# Altium schematic sheet Schematic.SchDoc
size 420 x 297 mm; SheetNumber: 1; SheetTotal: 1
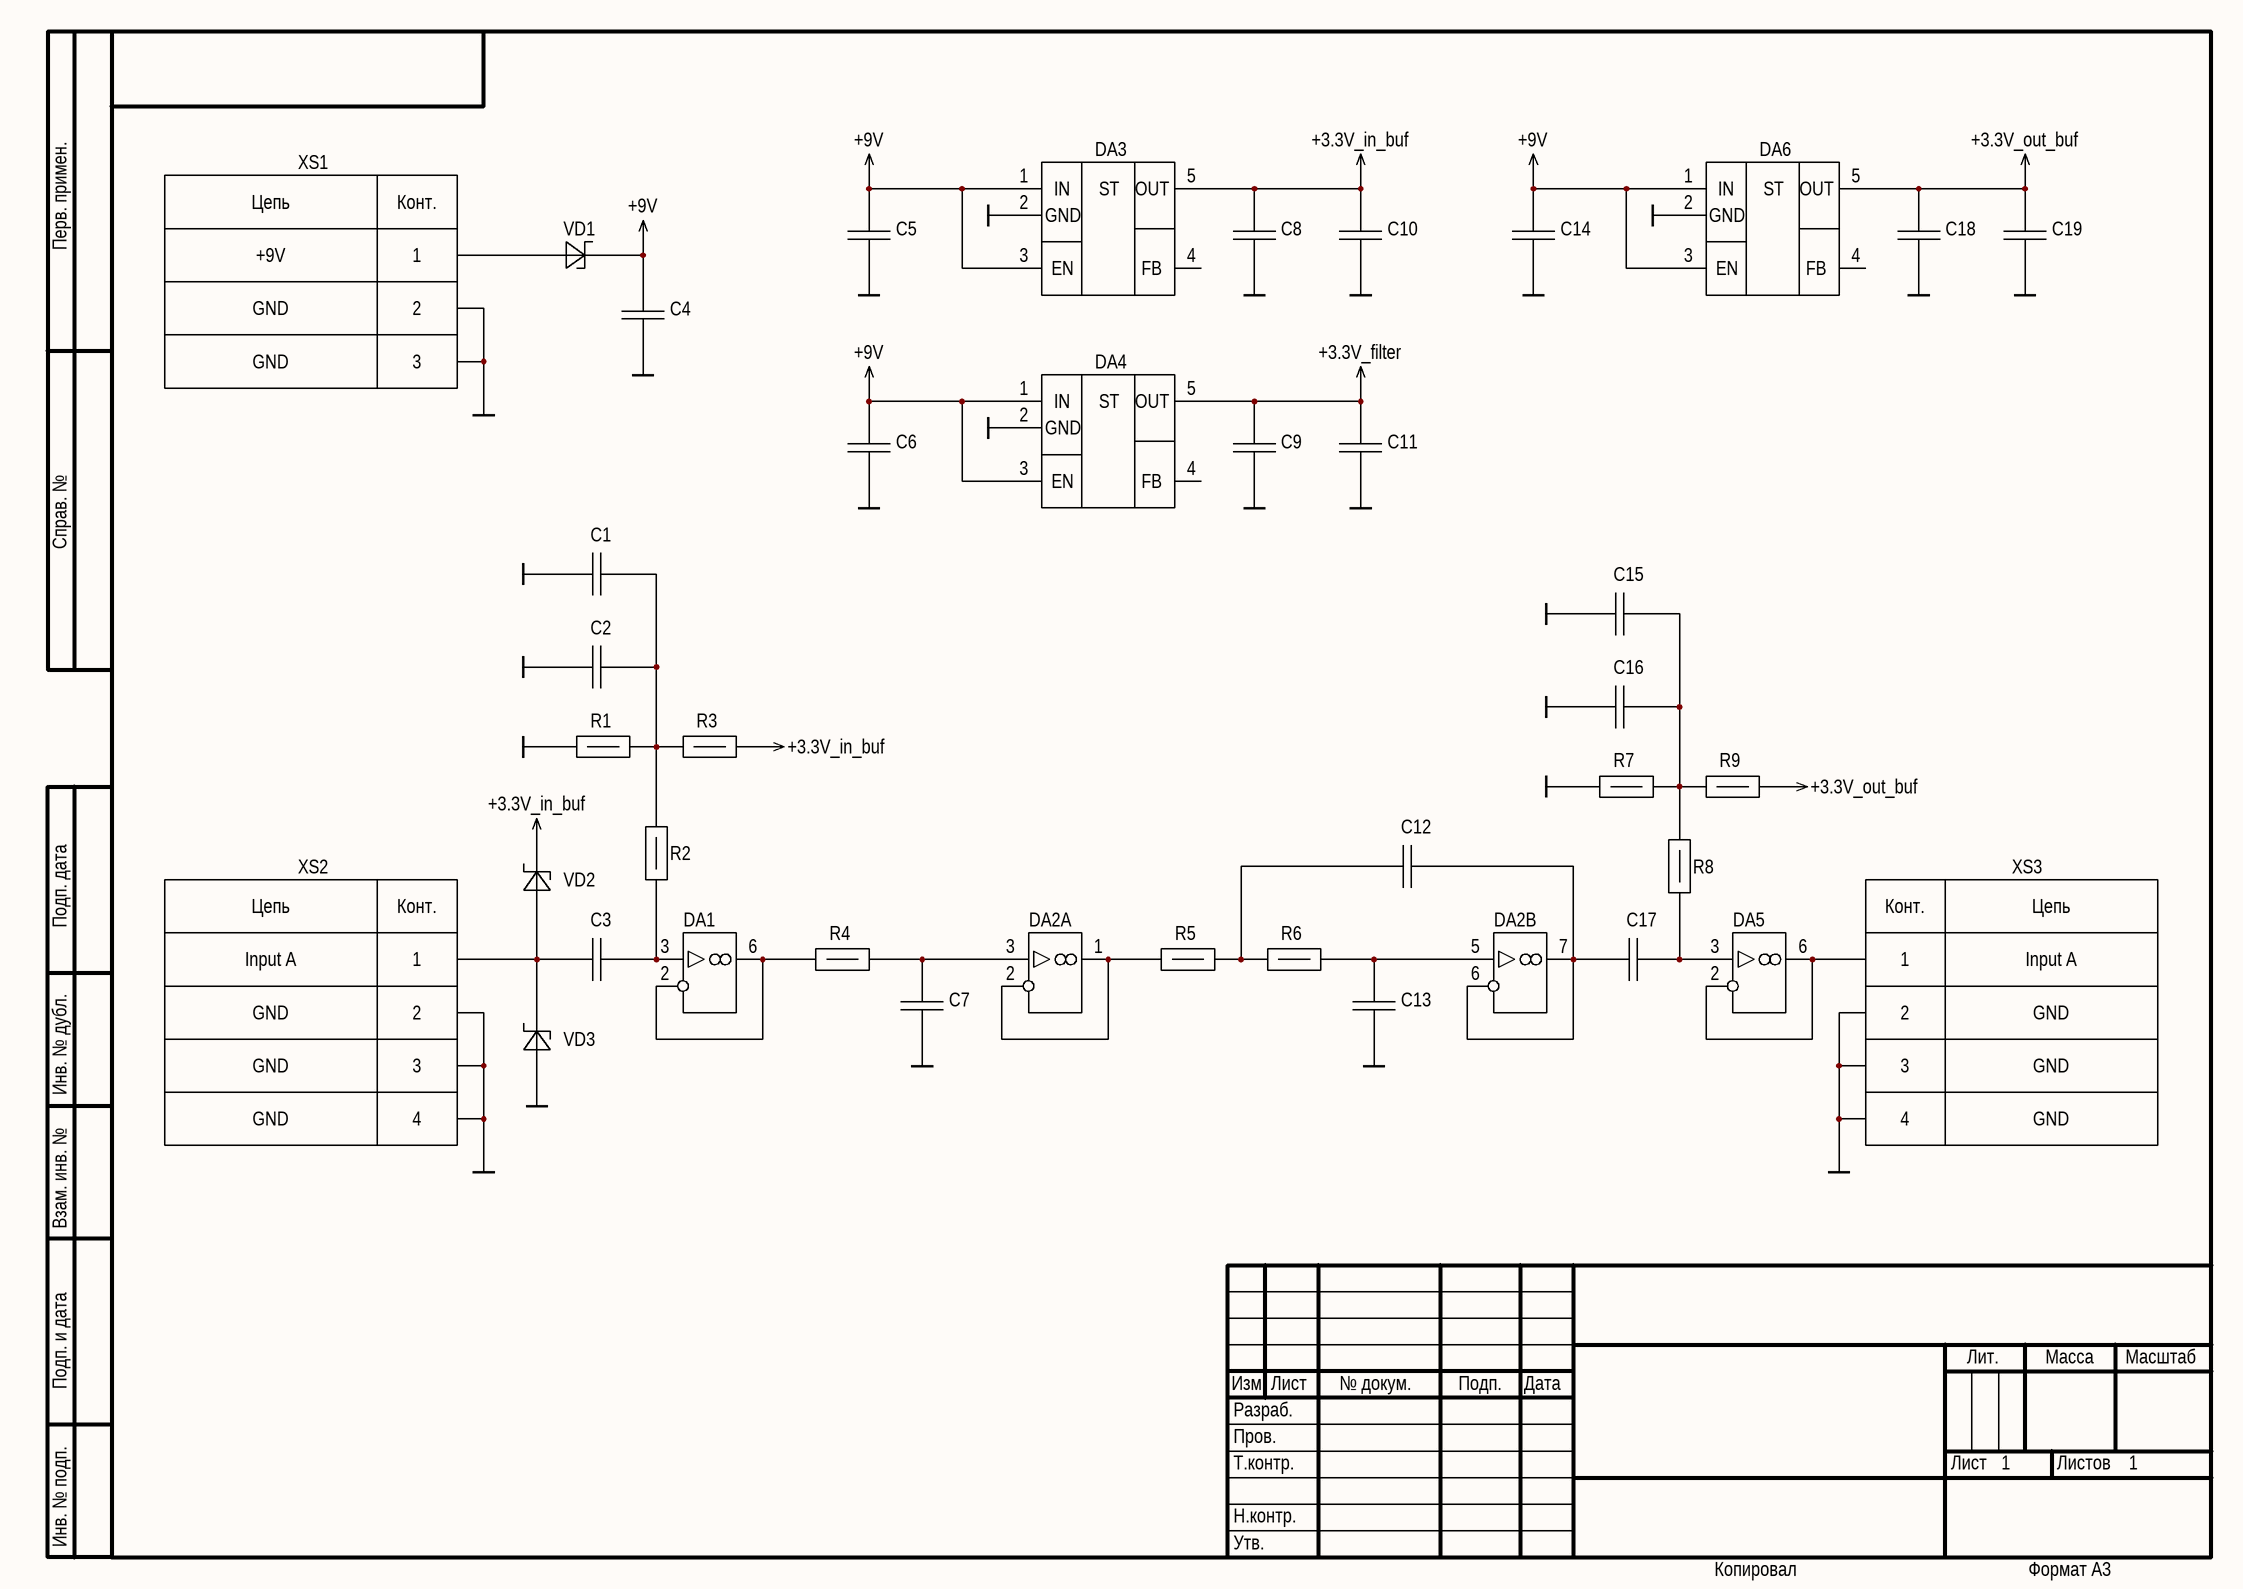
[diagram p0: Schematic.SchDoc]

## Parts
C1  10 uF x 10 V  [CAPC2012X06N]  (value not drawn)
C2  0.1 uF x 100 V  [CAPC2012X06N]  (value not drawn)
C3  0.1 uF x 100 V  [CAPC2012X06N]  (value not drawn)
C4  10 uF x 10 V  [CAPC2012X06N]  (value not drawn)
C5  10 uF x 10 V  [CAPC2012X06N]  (value not drawn)
C6  10 uF x 10 V  [CAPC2012X06N]  (value not drawn)
C7  1 nF x 450 V  [CAPC2012X06N]  (value not drawn)
C8  0.1 uF x 100 V  [CAPC2012X06N]  (value not drawn)
C9  0.1 uF x 100 V  [CAPC2012X06N]  (value not drawn)
C10  10 uF x 10 V  [CAPC2012X06N]  (value not drawn)
C11  10 uF x 10 V  [CAPC2012X06N]  (value not drawn)
C12  2 nF x 25 V  [CAPC2012X06N]  (value not drawn)
C13  1 nF x 450 V  [CAPC2012X06N]  (value not drawn)
C14  10 uF x 10 V  [CAPC2012X06N]  (value not drawn)
C15  10 uF x 10 V  [CAPC2012X06N]  (value not drawn)
C16  0.1 uF x 100 V  [CAPC2012X06N]  (value not drawn)
C17  0.1 uF x 100 V  [CAPC2012X06N]  (value not drawn)
C18  0.1 uF x 100 V  [CAPC2012X06N]  (value not drawn)
C19  10 uF x 10 V  [CAPC2012X06N]  (value not drawn)
DA1  OPA735AID  [D0008A]  (value not drawn)
DA2  OPA2735AIDGKR  [DGK0008A]  (value not drawn)  (parts A,B of 2)
DA3  TPS76333DBVT  [DBV0005A]  (value not drawn)
DA4  TPS76333DBVT  [DBV0005A]  (value not drawn)
DA5  OPA735AID  [D0008A]  (value not drawn)
DA6  TPS76333DBVT  [DBV0005A]  (value not drawn)
R1  100 kOhms  [RESC2012X06N]  (value not drawn)
R2  100 kOhms  [RESC2012X06N]  (value not drawn)
R3  100 kOhms  [RESC2012X06N]  (value not drawn)
R4  8.06 kOhms  [RESC2012X06N]  (value not drawn)
R5  4.42 kOhms  [RESC2012X06N]  (value not drawn)
R6  6.19 kOhms  [RESC2012X06N]  (value not drawn)
R7  100 kOhms  [RESC2012X06N]  (value not drawn)
R8  100 kOhms  [RESC2012X06N]  (value not drawn)
R9  100 kOhms  [RESC2012X06N]  (value not drawn)
VD1  BAT54W-HG3-18  [SOD-123]  (value not drawn)
VD2  BAT54W-HG3-18  [SOD-123]  (value not drawn)
VD3  BAT54W-HG3-18  [SOD-123]  (value not drawn)
XS1  PJ-002AH  [PJ-002AH (Same Sky)]  (value not drawn)
XS2  0731385003  [0731385003 (Molex)]  (value not drawn)
XS3  0731385003  [0731385003 (Molex)]  (value not drawn)

## Nets
+3.3V_filter: C9.1 C11.1 DA4.5(OUT)
+3.3V_in_buf: C8.1 C10.1 DA3.5(OUT) R3.1 VD2.1
+3.3V_out_buf: C18.1 C19.1 DA6.5(OUT) R9.1
+9V: C4.1 C5.1 C6.1 C14.1 DA3.1(IN) DA3.3(EN) DA4.1(IN) DA4.3(EN) DA6.1(IN) DA6.3(EN) VD1.1
GND: C1.1 C2.2 C4.2 C5.2 C6.2 C7.2 C8.2 C9.2 C10.2 C11.2 C13.2 C14.2 C15.1 C16.2 C18.2 C19.2 DA3.2(GND) DA4.2(GND) DA6.2(GND) R1.2 R7.2 VD3.2 XS1.2(GND) XS1.3(GND) XS2.2(GND) XS2.3(GND) XS2.4(GND) XS3.2(GND) XS3.3(GND) XS3.4(GND)
NetC1_2: C1.2 C2.1 R1.1 R2.2 R3.2
NetC3_1: C3.1 DA1.3(+IN) R2.1
NetC3_2: C3.2 VD2.2 VD3.1 XS2.1(Input_A)
NetC7_1: C7.1 DA2.3(+IN_A) R4.2
NetC12_1: C12.1 R5.2 R6.1
NetC12_2: C12.2 C17.2 DA2.6(-IN_B) DA2.7(OUT_B)
NetC13_1: C13.1 DA2.5(+IN_B) R6.2
NetC15_2: C15.2 C16.1 R7.1 R8.2 R9.2
NetC17_1: C17.1 DA5.3(+IN) R8.1
NetDA1_2: DA1.2(-IN) DA1.6(OUT) R4.1
NetDA2_1: DA2.1(OUT_A) DA2.2(-IN_A) R5.1
NetDA5_2: DA5.2(-IN) DA5.6(OUT) XS3.1(Input_A)
NetVD1_2: VD1.2 XS1.1(+9V)

Not connected (* = marked no-connect by the designer): DA3 4(FB); DA4 4(FB); DA6 4(FB)

## Notes on the sheet
- Перв. примен.
- Справ. №
- Подп. дата
- Инв. № дубл.
- Взам. инв. №
- Подп. и дата
- Изм
- Лист
- № докум.
- Подп.
- Дата
- Лит.
- Масса
- Масштаб
- Разраб.
- Пров.
- Т.контр.
- Листов
- Инв. № подп.
- Н.контр.
- Утв.
- Копировал
- Формат А3
- (in symbol 0731385003) Цепь; Конт.
- (in symbol PJ-002AH) Цепь; Конт.
- (in symbol TPS76333DBVT) ST

## Library data of the parts
C1 C4-C6 C10 C11 C14 C15 C19 = KGM21AR71A106KU: MLCC - Multilayer Ceramic Capacitors; Capacitance: 10 uF; Voltage Rating: 10 V; Tolerance: 10%; Package: 0805
C2 C3 C8 C9 C16-C18 = C2012X7R2A104K125AE: MLCC - Multilayer Ceramic Capacitors; Capacitance: 0.1 uF; Voltage Rating: 100 V; Tolerance: 10%; Package: 0805
C7 C13 = C2012NP02W102J060AA: MLCC - Multilayer Ceramic Capacitors; Capacitance: 1 nF; Voltage Rating: 450 V; Tolerance: 5%; Package: 0805
C12 = 08053A202JAT2A: MLCC - Multilayer Ceramic Capacitors; Capacitance: 2 nF; Voltage Rating: 25 V; Tolerance: 5%; Package: 0805
DA1 DA5 = OPA735AID: 0.05µV/°C max, SINGLE-SUPPLY CMOS OPERATIONAL AMPLIFIERS Zer∅-Drift Series
DA2 = OPA2735AIDGKR: 0.05µV/°C max, SINGLE-SUPPLY CMOS OPERATIONAL AMPLIFIERS Zer∅-Drift Series
DA3 DA4 DA6 = TPS76333DBVT: 150mA, 10V, Low-Dropout Voltage Regulator
R1-R3 R7-R9 = ERJ-HP6J104V: Thick Film Chip Resistors; Tolerance: 5%; Resistance: 100 kOhms; Package: 0805
R4 = ERJ-P06F8061V: Thick Film Chip Resistors; Tolerance: 1%; Resistance: 8.06 kOhms; Package: 0805
R5 = ERJ-6RBD4421V: Thick Film Chip Resistors; Tolerance: 0.5%; Resistance: 4.42 kOhms; Package: 0805
R6 = ERJ-HP6F6191V: Thick Film Chip Resistors; Tolerance: 1%; Resistance: 6.19 kOhms; Package: 0805
VD1-VD3 = BAT54W-HG3-18: Schottky Diodes & Rectifiers 30V Schottky DIODE
XS1 = PJ-002AH: DC POWER JACK
XS2 XS3 = 0731385003: BNC Connector Jack